# Altium schematic sheet VertBallControl.SchDoc: Vertical Ball Control
size A4
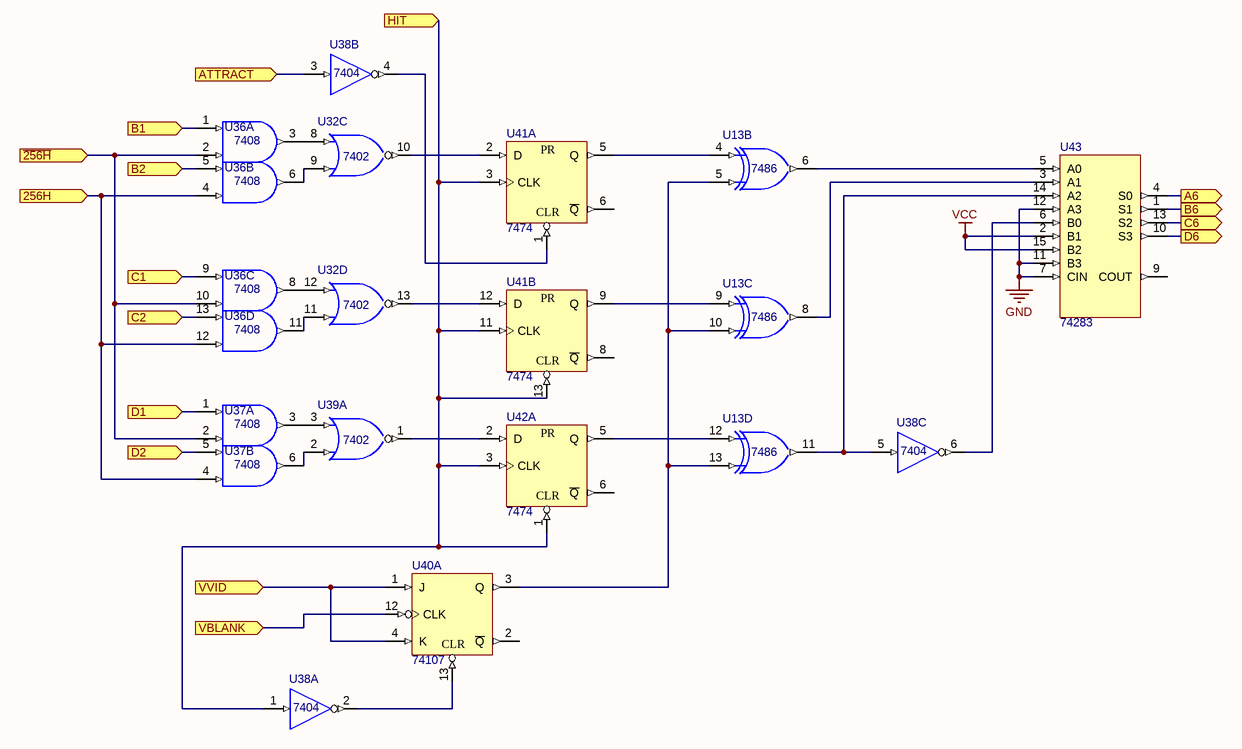
[diagram p0: VertBallControl.SchDoc]

## Parts
U13  7486  [N014]  (parts B,C,D of 4)
U32  7402  [N014]  (parts C,D of 4)
U36  7408  [N014]  (parts A,B,C,D of 4)
U37  7408  [N014]  (parts A,B of 4)
U38  7404  [N014]  (parts A,B,C of 6)
U39  7402  [N014]  (part A of 4)
U40  74107  [N014]  (part A of 2)
U41  7474  [N014D]  (parts A,B of 2)
U42  7474  [N014D]  (part A of 2)
U43  74283  [N016D]

## Ports
256H, A6, ATTRACT, B1, B2, B6, C1, C2, C6, D1, D2, D6, HIT, VBLANK, VVID, ~{256H}

## Nets
GND: U13.7(GND) U32.7(GND) U36.7(GND) U37.7(GND) U38.7(GND) U39.7(GND) U40.7(GND) U41.7(GND) U42.7(GND) U43.7(CIN) U43.8(GND) U43.11(B3) U43.12(A3)
VCC: U13.14(VCC) U32.14(VCC) U36.14(VCC) U37.14(VCC) U38.14(VCC) U39.14(VCC) U40.14(VCC) U41.4(PR) U41.10(PR) U41.14(VCC) U42.4(PR) U42.14(VCC) U43.2(B1) U43.15(B2) U43.16(VCC)
256H: U36.4(A) U36.12(A) U37.4(A) ; port 256H
~{256H}: U36.2(B) U36.10(B) U37.2(B) ; port ~{256H}
A6: U43.4(S0) ; port A6
ATTRACT: U38.3(A) ; port ATTRACT
B1: U36.1(A) ; port B1
B2: U36.5(B) ; port B2
B6: U43.1(S1) ; port B6
C1: U36.9(A) ; port C1
C2: U36.13(B) ; port C2
C6: U43.13(S2) ; port C6
D1: U37.1(A) ; port D1
D2: U37.5(B) ; port D2
D6: U43.10(S3) ; port D6
HIT: U38.1(A) U41.3(CLK) U41.11(CLK) U41.13(CLR) U42.1(CLR) U42.3(CLK) ; port HIT
VBLANK: U40.12(CLK) ; port VBLANK
VVID: U40.1(J) U40.4(K) ; port VVID
NetU13_4: U13.4(A) U41.5(Q)
NetU13_5: U13.5(B) U13.10(B) U13.13(B) U40.3(Q)
NetU13_6: U13.6(Y) U43.5(A0)
NetU13_8: U13.8(Y) U43.3(A1)
NetU13_9: U13.9(A) U41.9(Q)
NetU13_11: U13.11(Y) U38.5(A) U43.14(A2)
NetU13_12: U13.12(A) U42.5(Q)
NetU32_8: U32.8(A) U36.3(Y)
NetU32_9: U32.9(B) U36.6(Y)
NetU32_10: U32.10(Y) U41.2(D)
NetU32_11: U32.11(A) U36.11(Y)
NetU32_12: U32.12(B) U36.8(Y)
NetU32_13: U32.13(Y) U41.12(D)
NetU37_3: U37.3(Y) U39.3(B)
NetU37_6: U37.6(Y) U39.2(A)
NetU38_2: U38.2(Y) U40.13(CLR)
NetU38_4: U38.4(Y) U41.1(CLR)
NetU38_6: U38.6(Y) U43.6(B0)
NetU39_1: U39.1(Y) U42.2(D)

Not connected (* = marked no-connect by the designer): U40 2(~{Q}); U41 6(~{Q}) 8(~{Q}); U42 6(~{Q}); U43 9(COUT)

## Notes on the sheet
- Text
- Page
- PONG

## Library data of the parts
U13 = SN74LS86AN: Quadruple 2-Input Exclusive-OR Gate; Published: 8-Jun-2000; LatestRevisionDate: 04-Mar-2005; LatestRevisionNote: Stylized 3D Model Added.; DatasheetVersion: Mar-1988; PackageVersion: Oct-1995; PackageReference: N014; Publisher: Altium Limited; PackageDescription: DIP; 14 Leads; Row Spacing 7.62 mm; Pitch 2.54 mm; ComponentLink1Description: Manufacturer Link; ComponentLink1URL: http://www.ti.com/; ComponentLink2Description: Datasheet; ComponentLink2URL: http://www-s.ti.com/sc/ds/sn74ls86a.pdf
U32 U39 = SN74LS02N: Quadruple 2-Input Positive-NOR Gate; Published: 8-Jun-2000; LatestRevisionDate: 04-Mar-2005; LatestRevisionNote: Stylized 3D Model Added.; DatasheetVersion: Mar-1988; PackageVersion: Oct-1995; PackageReference: N014; Publisher: Altium Limited; PackageDescription: DIP; 14 Leads; Row Spacing 7.62 mm; Pitch 2.54 mm; ComponentLink1Description: Manufacturer Link; ComponentLink1URL: http://www.ti.com/; ComponentLink2Description: Datasheet; ComponentLink2URL: http://www-s.ti.com/sc/ds/sn54s02.pdf
U36 U37 = SN74LS08N: Quadruple 2-Input Positive-AND Gate; Published: 8-Jun-2000; LatestRevisionDate: 04-Mar-2005; LatestRevisionNote: Stylized 3D Model Added.; DatasheetVersion: Mar-1988; PackageVersion: Oct-1995; PackageReference: N014; Publisher: Altium Limited; PackageDescription: DIP; 14 Leads; Row Spacing 7.62 mm; Pitch 2.54 mm; ComponentLink1Description: Manufacturer Link; ComponentLink1URL: http://www.ti.com/; ComponentLink2Description: Datasheet; ComponentLink2URL: http://www-s.ti.com/sc/ds/SN74LS08.pdf
U38 = SN74LS04N: Hex Inverter; Published: 8-Jun-2000; LatestRevisionDate: 04-Mar-2005; LatestRevisionNote: Stylized 3D Model Added.; DatasheetVersion: Mar-1988; PackageVersion: Oct-1995; PackageReference: N014; Publisher: Altium Limited; PackageDescription: DIP; 14 Leads; Row Spacing 7.62 mm; Pitch 2.54 mm; ComponentLink1Description: Manufacturer Link; ComponentLink1URL: http://www.ti.com/; ComponentLink2Description: Datasheet; ComponentLink2URL: http://www-s.ti.com/sc/ds/sn74ls04.pdf
U40 = SN74LS107AN: Dual J-K Flip-Flop with Clear; Published: 8-Jun-2000; LatestRevisionDate: 04-Mar-2005; LatestRevisionNote: Stylized 3D Model Added.; DatasheetVersion: Mar-1988; PackageVersion: Oct-1995; PackageReference: N014; Publisher: Altium Limited; PackageDescription: DIP; 14 Leads; Row Spacing 7.62 mm; Pitch 2.54 mm; ComponentLink1Description: Manufacturer Link; ComponentLink1URL: http://www.ti.com/; ComponentLink2Description: Datasheet; ComponentLink2URL: http://www-s.ti.com/sc/ds/sn74ls107a.pdf
U41 U42 = SN74LS74AN: Dual D-Type Positive-Edge-Triggered Flip-Flop with Preset and Clear; Published: 8-Jun-2000; LatestRevisionDate: 04-Mar-2005; LatestRevisionNote: Stylized 3D Model Added.; DatasheetVersion: Mar-1988; PackageVersion: Oct-1995; PackageReference: N014D; Publisher: Altium Limited; PackageDescription: DIP; 14 Leads; Row Spacing 7.62 mm; Pitch 2.54 mm; ComponentLink1Description: Manufacturer Link; ComponentLink1URL: http://www.ti.com/; ComponentLink2Description: Datasheet; ComponentLink2URL: http://www-s.ti.com/sc/ds/sn74ls74a.pdf
U43 = SN54S283FK: 4-Bit Binary Full Adder with Fast Carry; Published: 8-Jun-2000; LatestRevisionDate: 04-Mar-2005; LatestRevisionNote: Stylized 3D Model Added.; DatasheetVersion: Mar-1988; PackageVersion: Oct-1995; PackageReference: N016D; Publisher: Altium Limited; PackageDescription: DIP; 16 Leads; Row Spacing 7.62 mm; Pitch 2.54 mm; Code_JEDEC: MS-001-BB; ComponentLink1Description: Manufacturer Link; ComponentLink1URL: http://www.ti.com; ComponentLink2Description: Datasheet; ComponentLink2URL: http://www-s.ti.com/sc/ds/sn54ls283.pdf